# Altium project minireg-adp7102.PrjPcb
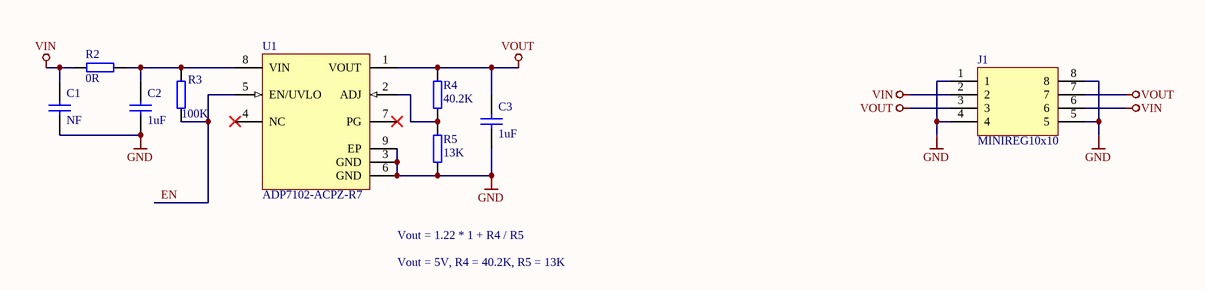
[diagram p0: minireg-adp7102.SchDoc]
Version: v0.1
1 sheet, 9 parts. Net scope: global (net labels, ports and power ports of the same name join across sheets).
Board files: minireg-adp7102-multi.PcbDoc, minireg-adp7102.PcbDoc

## Sheet minireg-adp7102.SchDoc
size A4; SheetNumber: 1; SheetTotal: 1

### Parts
C1  value NF  [CAP0603]  (hidden comment: CAP)
C2  value 1uF  [CAP0603]  (hidden comment: CAP)
C3  value 1uF  [CAP0603]  (hidden comment: CAP)
J1  MINIREG10x10  [MINIREG8_10x10R]
R2  value 0R  [RES0603]  (hidden comment: RES)
R3  value 100K  [RES0603]  (hidden comment: RES)
R4  value 40.2K  [RES0603]  (hidden comment: RES)
R5  value 13K  [RES0603]  (hidden comment: RES)
U1  ADP7102-ACPZ-R7  [ADP7102ACPZ-R7]

### Nets
GND: C1.1 C2.1 C3.1 J1.1 J1.4 J1.5 J1.8 R5.1 U1.3(GND) U1.6(GND) U1.9(EP)
VIN: C1.2 J1.2 J1.6 R2.1
VOUT: C3.2 J1.3 J1.7 R4.2 U1.1(VOUT)
EN: R3.1 U1.5(EN/UVLO)
NetC2_2: C2.2 R2.2 R3.2 U1.8(VIN)
NetR4_1: R4.1 R5.2 U1.2(ADJ)

Not connected (* = marked no-connect by the designer): U1 4(NC)* 7(PG)*

### Notes on the sheet
- Vout = 1.22 * 1 + R4 / R5
- Vout = 5V, R4 = 40.2K, R5 = 13K

### Library data of the parts
C1 = CAP-SM-0603-NF: CAP SM 0603 N/F; Manufacturer: GENERIC; Part Number: CAP-SM-0603-NF; Package: 0603
C2 C3 = CAP-SM-0603-X7R-1uF: CAP SM 0603 X7R 1uF; Manufacturer: GENERIC; Part Number: CAP-SM-0603-X7R-1uF; Package: 0603
R2 = RES-SM-0603-0R: RES SM 0603 0R; Manufacturer: GENERIC; Part Number: RES-SM-0603-0R; Package: 0603
R3 = RES-SM-0603-100K: RES SM 0603 100K; Manufacturer: GENERIC; Part Number: RES-SM-0603-100K; Package: 0603
R4 = RES-SM-0603-40.2K: RES SM 0603 40.2K; Manufacturer: GENERIC; Part Number: RES-SM-0603-40.2K; Package: 0603
R5 = RES-SM-0603-13K: RES SM 0603 10K; Manufacturer: GENERIC; Part Number: RES-SM-0603-13K; Package: 0603
U1 = ADP7102-ACPZ: 300 mA, Low Noise, CMOS LDO, 3.3 to 20 V Vin, 1.22 to Vin-Vdo Vout, Industrial, 8-pin SON (CP-8-5), Reel; Manufacturer: Analog Devices; Vin (min) (V): 3.3; Vin (max) (V): 20; Vout Adjustable Range: 1.22V to 19V; Iout max: 300mA; Supply Current IGND @ Small Load: 400uA; ComponentLink3URL: http://www.analog.com/static/imported-files/packages/PKG_PDF/LFCSP(CP)/CP_8_5.pdf; ComponentLink3Description: Package Specification; ComponentLink1URL: http://www.analog.com/en/index.html; ComponentLink4URL: Product URL:http://www.analog.com/en/ADP7102/productSearch.html; DatasheetVersion: Rev. A; PartNumber: ADP7102ACPZ-R7; PackageDescription: 8-Pin Lead Frame Chip Scale Package, Body 3 x 3 mm, Pitch 0.5 mm; Packing: Reel; ComponentLink2Description: Datasheet; ComponentLink4Description: URL Link1; ComponentLink1Description: Manufacturer URL; ComponentLink2URL: http://www.analog.com/static/imported-files/data_sheets/ADP7102.pdf; Mounting Technology: Surface Mount; PackageVersion: 031208-A, 03/2008; PackageReference: CP-8-5

## Assembly variants
minireg-adp7102-5v0: all parts fitted
minireg-adp7102-3V3: all parts fitted